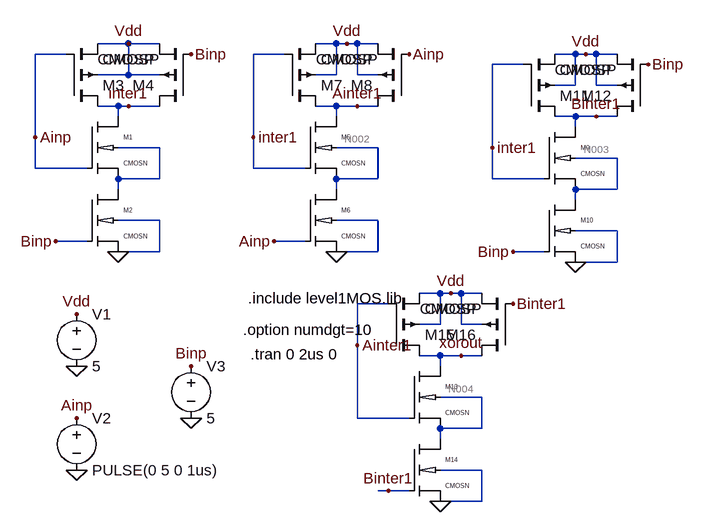
[diagram p0: schematic XOR.asc]
XOR.asc, the LTspice schematic file:
Version 4
SHEET 1 880 680
WIRE -208 -96 -256 -96
WIRE -160 -96 -208 -96
WIRE 112 -96 80 -96
WIRE 128 -96 112 -96
WIRE 144 -96 128 -96
WIRE 176 -96 144 -96
WIRE -304 -80 -352 -80
WIRE 32 -80 -16 -80
WIRE 480 -80 448 -80
WIRE 496 -80 480 -80
WIRE 512 -80 496 -80
WIRE 544 -80 512 -80
WIRE 400 -64 352 -64
WIRE -208 -48 -208 -96
WIRE -208 -48 -256 -48
WIRE -160 -48 -208 -48
WIRE 112 -48 112 -96
WIRE 112 -48 80 -48
WIRE 144 -48 144 -96
WIRE 176 -48 144 -48
WIRE 480 -32 480 -80
WIRE 480 -32 448 -32
WIRE 512 -32 512 -80
WIRE 544 -32 512 -32
WIRE -224 0 -256 0
WIRE -208 0 -224 0
WIRE -160 0 -208 0
WIRE 112 0 80 0
WIRE 144 0 112 0
WIRE 176 0 144 0
WIRE -224 16 -224 0
WIRE 112 16 112 0
WIRE 480 16 448 16
WIRE 512 16 480 16
WIRE 544 16 512 16
WIRE 480 32 480 16
WIRE -352 48 -352 -80
WIRE -16 48 -16 -80
WIRE -160 64 -224 64
WIRE 176 64 112 64
WIRE 352 64 352 -64
WIRE 544 80 480 80
WIRE -352 96 -352 48
WIRE -272 96 -352 96
WIRE -16 96 -16 48
WIRE 64 96 -16 96
WIRE -160 112 -160 64
WIRE -160 112 -224 112
WIRE 176 112 176 64
WIRE 176 112 112 112
WIRE 352 112 352 64
WIRE 432 112 352 112
WIRE -224 128 -224 112
WIRE 112 128 112 112
WIRE 544 128 544 80
WIRE 544 128 480 128
WIRE 480 144 480 128
WIRE -160 176 -224 176
WIRE 176 176 112 176
WIRE 544 192 480 192
WIRE -272 208 -320 208
WIRE 64 208 16 208
WIRE -160 224 -160 176
WIRE -160 224 -224 224
WIRE 176 224 176 176
WIRE 176 224 112 224
WIRE 432 224 384 224
WIRE 544 240 544 192
WIRE 544 240 480 240
WIRE 272 288 240 288
WIRE 288 288 272 288
WIRE 304 288 288 288
WIRE 336 288 304 288
WIRE 192 304 144 304
WIRE 272 336 272 288
WIRE 272 336 240 336
WIRE 304 336 304 288
WIRE 336 336 304 336
WIRE 144 368 144 304
WIRE 272 384 240 384
WIRE 304 384 272 384
WIRE 336 384 304 384
WIRE 272 400 272 384
WIRE 336 448 272 448
WIRE 144 480 144 368
WIRE 224 480 144 480
WIRE 336 496 336 448
WIRE 336 496 272 496
WIRE 272 512 272 496
WIRE 336 560 272 560
WIRE 192 592 176 592
WIRE 224 592 192 592
WIRE 336 608 336 560
WIRE 336 608 272 608
FLAG -224 224 0
FLAG -352 48 Ainp
FLAG -320 208 Binp
FLAG -112 -80 Binp
FLAG -208 -96 Vdd
FLAG 112 224 0
FLAG -16 48 inter1
FLAG 16 208 Ainp
FLAG 224 -80 Ainp
FLAG 128 -96 Vdd
FLAG 480 240 0
FLAG 352 64 inter1
FLAG 384 224 Binp
FLAG 592 -64 Binp
FLAG 496 -80 Vdd
FLAG 272 608 0
FLAG 288 288 Vdd
FLAG -208 0 inter1
FLAG 144 0 Ainter1
FLAG 144 368 Ainter1
FLAG 512 16 Binter1
FLAG 192 592 Binter1
FLAG 384 304 Binter1
FLAG 304 384 xorout
FLAG -112 480 0
FLAG -288 560 0
FLAG -288 400 0
FLAG -288 320 Vdd
FLAG -288 480 Ainp
FLAG -112 400 Binp
SYMBOL cmosn -272 16 R0
SYMATTR InstName M1
SYMATTR Value2 l=0.36u w=0.72u
SYMBOL cmosn -272 128 R0
SYMATTR InstName M2
SYMATTR Value2 l=0.36u w=0.72u
SYMBOL cmosp -304 0 M180
SYMATTR InstName M3
SYMATTR Value2 l=0.36u w=0.36u
SYMBOL cmosp -112 0 R180
SYMATTR InstName M4
SYMATTR Value2 l=0.36u w=0.36u
SYMBOL cmosn 64 16 R0
SYMATTR InstName M5
SYMATTR Value2 l=0.36u w=0.72u
SYMBOL cmosn 64 128 R0
SYMATTR InstName M6
SYMATTR Value2 l=0.36u w=0.72u
SYMBOL cmosp 32 0 M180
SYMATTR InstName M7
SYMATTR Value2 l=0.36u w=0.36u
SYMBOL cmosp 224 0 R180
SYMATTR InstName M8
SYMATTR Value2 l=0.36u w=0.36u
SYMBOL cmosn 432 32 R0
SYMATTR InstName M9
SYMATTR Value2 l=0.36u w=0.72u
SYMBOL cmosn 432 144 R0
SYMATTR InstName M10
SYMATTR Value2 l=0.36u w=0.72u
SYMBOL cmosp 400 16 M180
SYMATTR InstName M11
SYMATTR Value2 l=0.36u w=0.36u
SYMBOL cmosp 592 16 R180
SYMATTR InstName M12
SYMATTR Value2 l=0.36u w=0.36u
SYMBOL cmosn 224 400 R0
SYMATTR InstName M13
SYMATTR Value2 l=0.36u w=0.72u
SYMBOL cmosn 224 512 R0
SYMATTR InstName M14
SYMATTR Value2 l=0.36u w=0.72u
SYMBOL cmosp 192 384 M180
SYMATTR InstName M15
SYMATTR Value2 l=0.36u w=0.36u
SYMBOL cmosp 384 384 R180
SYMATTR InstName M16
SYMATTR Value2 l=0.36u w=0.36u
SYMBOL voltage -288 304 R0
WINDOW 123 0 0 Left 2
WINDOW 39 0 0 Left 2
SYMATTR InstName V1
SYMATTR Value 5
SYMBOL voltage -288 464 R0
WINDOW 123 0 0 Left 2
WINDOW 39 0 0 Left 2
SYMATTR InstName V2
SYMATTR Value PULSE(0 5 0 1us)
SYMBOL voltage -112 384 R0
WINDOW 123 0 0 Left 2
WINDOW 39 0 0 Left 2
SYMATTR InstName V3
SYMATTR Value 5
TEXT -20 382 Left 2 !.tran 0 2us 0
TEXT -24 296 Left 2 !.include level1MOS.lib
TEXT -32 344 Left 2 !.option numdgt=10

The netlist it stands for:
* XOR.asc
M1 inter1 Ainp N001 N001 CMOSN l=0.36u w=0.72u
M2 N001 Binp 0 0 CMOSN l=0.36u w=0.72u
M3 inter1 Ainp Vdd Vdd CMOSP l=0.36u w=0.36u
M4 inter1 Binp Vdd Vdd CMOSP l=0.36u w=0.36u
M5 Ainter1 inter1 N002 N002 CMOSN l=0.36u w=0.72u
M6 N002 Ainp 0 0 CMOSN l=0.36u w=0.72u
M7 Ainter1 inter1 Vdd Vdd CMOSP l=0.36u w=0.36u
M8 Ainter1 Ainp Vdd Vdd CMOSP l=0.36u w=0.36u
M9 Binter1 inter1 N003 N003 CMOSN l=0.36u w=0.72u
M10 N003 Binp 0 0 CMOSN l=0.36u w=0.72u
M11 Binter1 inter1 Vdd Vdd CMOSP l=0.36u w=0.36u
M12 Binter1 Binp Vdd Vdd CMOSP l=0.36u w=0.36u
M13 xorout Ainter1 N004 N004 CMOSN l=0.36u w=0.72u
M14 N004 Binter1 0 0 CMOSN l=0.36u w=0.72u
M15 xorout Ainter1 Vdd Vdd CMOSP l=0.36u w=0.36u
M16 xorout Binter1 Vdd Vdd CMOSP l=0.36u w=0.36u
V1 Vdd 0 5
V2 Ainp 0 PULSE(0 5 0 1us)
V3 Binp 0 5
.model NMOS NMOS
.model PMOS PMOS
.lib standard.mos
.tran 0 2us 0
.include level1MOS.lib
.option numdgt=10
.lib tsmc018.lib
.backanno
.end

* Results of the author's LTspice run, read from the files saved beside the schematic
* Operating Point, zero values left out:
*   V(inter1) = 5 V
*   V(binp) = 5 V
*   V(vdd) = 5 V
*   V(ainter1) = 5 V
*   V(n002) = 4.523 V
*   V(binter1) = 15.53 nV
*   V(n003) = 7.765 nV
*   V(xorout) = 5 V
*   V(n004) = 4.52 V
*   Id(M16) = -9.05 pA
*   Is(M16) = 9.05 pA
*   Id(M12) = -10.01 pA
*   Ib(M12) = 5.01 pA
*   Is(M12) = 5 pA
*   Id(M11) = -10.01 pA
*   Ib(M11) = 5.01 pA
*   Is(M11) = 5 pA
*   Id(M8) = -9.056 pA
*   Is(M8) = 9.056 pA
*   Id(M3) = -10.01 pA
*   Is(M3) = 10.01 pA
*   Id(M14) = 9.05 pA
*   Ib(M14) = -4.53 pA
*   Is(M14) = -4.52 pA
*   Id(M13) = 2.534 nA
*   Is(M13) = -2.533 nA
*   Id(M10) = 20.02 pA
*   Is(M10) = -20.02 pA
*   Id(M9) = 20.02 pA
*   Is(M9) = -20.02 pA
*   Id(M6) = 9.056 pA
*   Ib(M6) = -4.533 pA
*   Is(M6) = -4.523 pA
*   Id(M5) = 9.056 pA
*   Is(M5) = -8.569 pA
*   Id(M2) = 10.01 pA
*   Is(M2) = -10.01 pA
*   Id(M1) = 10.01 pA
*   Ib(M1) = -5.01 pA
*   Is(M1) = -5 pA
*   I(V1) = -48.14 pA
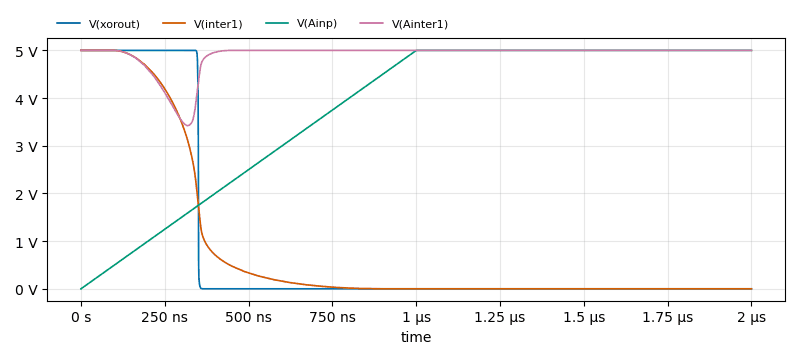
[diagram p1: Transient Analysis of XOR.asc, plotted from the saved traces]
* Transient Analysis, 1 run:
*   V(xorout): min 0 V, max 5 V, average 874.9 mV, rms 2.089 V, last 0 V
*   V(inter1): min 0 V, max 5 V, average 841 mV, rms 1.885 V, last 0 V
*   V(Ainp): min 0 V, max 5 V, average 3.75 V, rms 4.083 V, last 5 V
*   V(Ainter1): min 3.423 V, max 5 V, average 4.908 V, rms 4.917 V, last 5 V